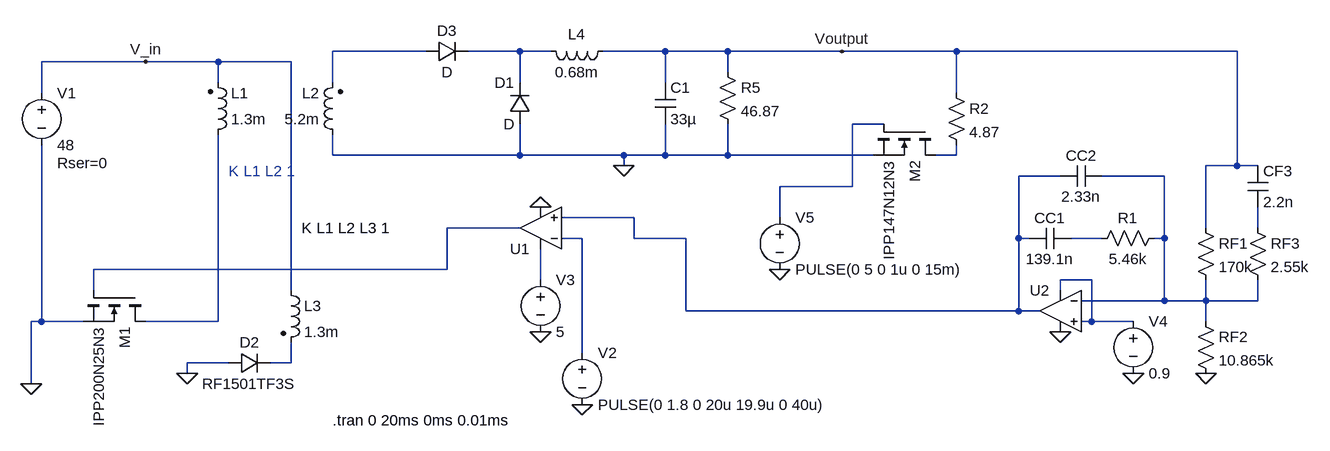
[diagram p0: schematic compansator_plotlari_al.asc]
compansator_plotlari_al.asc, the LTspice schematic file:
Version 4
SHEET 1 1424 740
WIRE 48 80 -96 80
WIRE 192 80 112 80
WIRE 240 80 192 80
WIRE 416 80 320 80
WIRE 512 80 416 80
WIRE 688 80 512 80
WIRE 864 80 688 80
WIRE 1296 80 864 80
WIRE -384 96 -544 96
WIRE -272 96 -384 96
WIRE -160 96 -272 96
WIRE 512 112 512 80
WIRE -272 128 -272 96
WIRE -96 128 -96 80
WIRE 192 128 192 80
WIRE 416 128 416 80
WIRE -544 144 -544 96
WIRE 864 144 864 80
WIRE 752 192 704 192
WIRE -96 240 -96 208
WIRE 192 240 192 192
WIRE 192 240 -96 240
WIRE 352 240 192 240
WIRE 416 240 416 192
WIRE 416 240 352 240
WIRE 512 240 512 192
WIRE 512 240 416 240
WIRE 736 240 512 240
WIRE 864 240 864 224
WIRE 864 240 832 240
WIRE 352 256 352 240
WIRE 1296 256 1296 80
WIRE 1296 256 1248 256
WIRE 1328 256 1296 256
WIRE 1024 272 960 272
WIRE 1184 272 1088 272
WIRE 704 288 704 192
WIRE 704 288 592 288
WIRE 368 336 256 336
WIRE 592 336 592 288
WIRE 192 352 80 352
WIRE 1248 352 1248 256
WIRE 1328 352 1328 320
WIRE 288 368 256 368
WIRE 368 368 368 336
WIRE 448 368 368 368
WIRE 960 368 960 272
WIRE 976 368 960 368
WIRE 1088 368 1040 368
WIRE 1184 368 1184 272
WIRE 1184 368 1168 368
WIRE 80 416 80 352
WIRE 80 416 -464 416
WIRE 224 432 224 384
WIRE 1072 432 1024 432
WIRE -464 448 -464 416
WIRE -160 448 -160 96
WIRE 1024 448 1024 432
WIRE 1184 464 1184 368
WIRE 1184 464 1056 464
WIRE 1248 464 1248 432
WIRE 1248 464 1184 464
WIRE 1328 464 1328 432
WIRE 1328 464 1248 464
WIRE 448 480 448 368
WIRE 960 480 960 368
WIRE 960 480 448 480
WIRE 992 480 960 480
WIRE -544 496 -544 224
WIRE -544 496 -560 496
WIRE -480 496 -544 496
WIRE -272 496 -272 208
WIRE -272 496 -384 496
WIRE 1072 496 1072 432
WIRE 1072 496 1056 496
WIRE 1136 496 1072 496
WIRE 1248 496 1248 464
WIRE 288 544 288 368
WIRE -256 560 -320 560
WIRE -160 560 -160 528
WIRE -160 560 -192 560
WIRE -320 576 -320 560
WIRE -560 592 -560 496
FLAG 224 320 0
FLAG 288 624 0
FLAG 224 512 0
FLAG 1024 512 0
FLAG 1136 576 0
FLAG 1248 576 0
FLAG 688 80 Voutput
FLAG 352 256 0
FLAG -384 96 V_in
FLAG -560 592 0
FLAG 592 416 0
FLAG -320 576 0
SYMBOL voltage -544 128 R0
WINDOW 123 0 0 Left 2
WINDOW 39 24 124 Left 2
SYMATTR SpiceLine Rser=0
SYMATTR InstName V1
SYMATTR Value 48
SYMBOL ind2 -288 224 M180
WINDOW 0 36 80 Left 2
WINDOW 3 36 40 Left 2
SYMATTR InstName L1
SYMATTR Value 1.3m
SYMATTR SpiceLine Rser=30m
SYMATTR Type ind
SYMBOL cap 400 128 R0
SYMATTR InstName C1
SYMATTR Value 33µ
SYMATTR SpiceLine Rser=3m
SYMBOL Opamps\\UniversalOpamp2 224 352 R180
SYMATTR InstName U1
SYMBOL voltage 288 528 R0
WINDOW 123 0 0 Left 2
WINDOW 39 0 0 Left 2
SYMATTR InstName V2
SYMATTR Value PULSE(0 1.8 0 20u 19.9u 0 40u)
SYMBOL voltage 224 416 R0
WINDOW 123 0 0 Left 2
WINDOW 39 0 0 Left 2
SYMATTR InstName V3
SYMATTR Value 5
SYMBOL res 1184 352 R90
WINDOW 0 0 56 VBottom 2
WINDOW 3 32 56 VTop 2
SYMATTR InstName R1
SYMATTR Value 5.46k
SYMBOL cap 1040 352 R90
WINDOW 0 0 32 VBottom 2
WINDOW 3 32 32 VTop 2
SYMATTR InstName CC1
SYMATTR Value 139.1n
SYMBOL cap 1088 256 R90
WINDOW 0 0 32 VBottom 2
WINDOW 3 32 32 VTop 2
SYMATTR InstName CC2
SYMATTR Value 2.33n
SYMBOL Opamps\\UniversalOpamp2 1024 480 M0
SYMATTR InstName U2
SYMBOL voltage 1136 480 R0
WINDOW 123 0 0 Left 2
WINDOW 39 0 0 Left 2
SYMATTR InstName V4
SYMATTR Value 0.9
SYMBOL res 1232 336 R0
SYMATTR InstName RF1
SYMATTR Value 170k
SYMBOL res 1312 336 R0
SYMATTR InstName RF3
SYMATTR Value 2.55k
SYMBOL cap 1312 256 R0
SYMATTR InstName CF3
SYMATTR Value 2.2n
SYMBOL res 1232 480 R0
SYMATTR InstName RF2
SYMATTR Value 10.865k
SYMBOL res 496 96 R0
SYMATTR InstName R5
SYMATTR Value 46.87
SYMBOL ind2 -80 224 R180
WINDOW 0 36 80 Left 2
WINDOW 3 36 40 Left 2
SYMATTR InstName L2
SYMATTR Value 5.2m
SYMATTR Type ind
SYMATTR SpiceLine Rser=40m
SYMBOL ind 336 64 R90
WINDOW 0 5 56 VBottom 2
WINDOW 3 32 56 VTop 2
SYMATTR InstName L4
SYMATTR Value 0.68m
SYMATTR SpiceLine Rser=60m
SYMBOL nmos -384 448 R90
SYMATTR InstName M1
SYMATTR Value IPP200N25N3
SYMBOL diode 208 192 R180
WINDOW 0 24 64 Left 2
WINDOW 3 24 0 Left 2
SYMATTR InstName D1
SYMBOL diode 48 96 R270
WINDOW 0 32 32 VTop 2
WINDOW 3 0 32 VBottom 2
SYMATTR InstName D3
SYMBOL nmos 832 192 R90
SYMATTR InstName M2
SYMATTR Value IPP147N12N3
SYMBOL res 848 128 R0
SYMATTR InstName R2
SYMATTR Value 4.87
SYMBOL voltage 592 320 R0
WINDOW 123 0 0 Left 2
WINDOW 39 0 0 Left 2
SYMATTR InstName V5
SYMATTR Value PULSE(0 5 0 1u 0 15m)
SYMBOL ind2 -176 432 R0
SYMATTR InstName L3
SYMATTR Value 1.3m
SYMATTR Type ind
SYMBOL diode -256 576 R270
WINDOW 0 32 32 VTop 2
WINDOW 3 0 32 VBottom 2
SYMATTR InstName D2
SYMATTR Value RF1501TF3S
TEXT -96 648 Left 2 !.tran 0 20ms 0ms 0.01ms
TEXT -256 264 Left 2 ;K L1 L2 1
TEXT -144 352 Left 2 !K L1 L2 L3 1

The netlist it stands for:
* compansator_plotlari_al.asc
V1 V_in 0 48 Rser=0
L1 N013 V_in 1.3m Rser=30m
C1 Voutput 0 33µ Rser=3m
XU1 N005 N009 N011 0 N007 level.2 Avol=1Meg GBW=10Meg Slew=10Meg ilimit=25m rail=0 Vos=0 phimargin=45 en=0 enk=0 in=0 ink=0 Rin=500Meg  ; pins IN+ IN- V+ V- OUT
V2 N009 0 PULSE(0 1.8 0 20u 19.9u 0 40u)
V3 N011 0 5
R1 N006 N010 5.46k
CC1 N010 N005 139.1n
CC2 N006 N005 2.33n
XU2 N012 N006 N012 0 N005 level.2 Avol=1Meg GBW=10Meg Slew=10Meg ilimit=25m rail=0 Vos=0 phimargin=45 en=0 enk=0 in=0 ink=0 Rin=500Meg  ; pins IN+ IN- V+ V- OUT
V4 N012 0 0.9
RF1 Voutput N006 170k
RF3 N008 N006 2.55k
CF3 Voutput N008 2.2n
RF2 N006 0 10.865k
R5 Voutput 0 46.87
L2 0 N001 5.2m Rser=40m
L4 Voutput N002 0.68m Rser=60m
M1 N013 N007 0 0 IPP200N25N3
D1 0 N002 D
D3 N001 N002 D
M2 N004 N003 0 0 IPP147N12N3
R2 Voutput N004 4.87
V5 N003 0 PULSE(0 5 0 1u 0 15m)
L3 V_in N014 1.3m
D2 0 N014 RF1501TF3S
.model D D
.lib standard.dio
.model NMOS NMOS
.model PMOS PMOS
.lib standard.mos
.tran 0 20ms 0ms 0.01ms
* K L1 L2 1
K L1 L2 L3 1
.lib UniversalOpamps2.sub
.backanno
.end